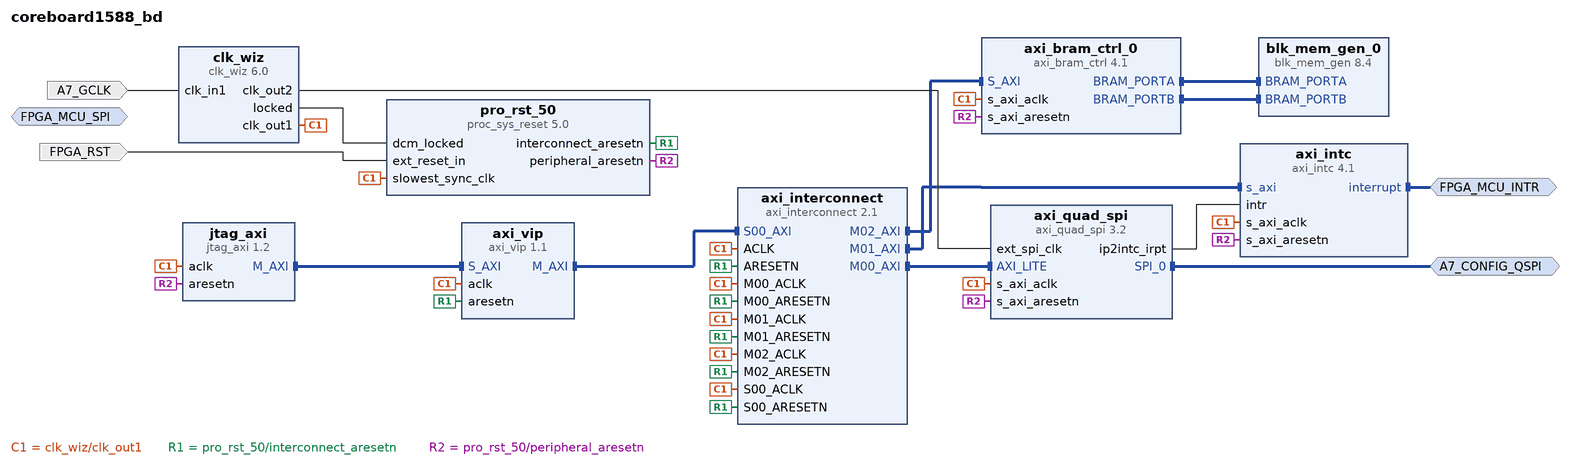
[diagram p0: block diagram of the top level]
# Vivado block design coreboard1588_bd, xc7a35tcsg324-2, Vivado 2019.2
create_bd_design coreboard1588_bd

create_bd_intf_port -mode Master -vlnv xilinx.com:interface:spi_rtl:1.0 A7_CONFIG_QSPI
create_bd_intf_port -mode Master -vlnv xilinx.com:interface:mbinterrupt_rtl:1.0 FPGA_MCU_INTR
create_bd_intf_port -mode Slave -vlnv xilinx.com:interface:spi_rtl:1.0 FPGA_MCU_SPI
create_bd_port -dir I -type rst FPGA_RST
set_property -dict {CONFIG.POLARITY ACTIVE_LOW} [get_bd_ports FPGA_RST]
create_bd_port -dir I -type clk A7_GCLK
set_property -dict {CONFIG.CLK_DOMAIN A7_GCLK CONFIG.FREQ_HZ 50000000} [get_bd_ports A7_GCLK]

create_bd_cell -type ip -vlnv xilinx.com:ip:jtag_axi:1.2 jtag_axi
set_property -dict {CONFIG.PROTOCOL 2} [get_bd_cells jtag_axi]
create_bd_cell -type ip -vlnv xilinx.com:ip:axi_interconnect:2.1 axi_interconnect
set_property -dict {CONFIG.NUM_MI 3} [get_bd_cells axi_interconnect]
create_bd_cell -type ip -vlnv xilinx.com:ip:axi_quad_spi:3.2 axi_quad_spi
set_property -dict {CONFIG.Async_Clk 0 CONFIG.C_SPI_MEMORY 2 CONFIG.C_SPI_MODE 2} [get_bd_cells axi_quad_spi]
create_bd_cell -type ip -vlnv xilinx.com:ip:clk_wiz:6.0 clk_wiz
set_property -dict [list \
  CONFIG.CLKOUT2_JITTER 249.363 \
  CONFIG.CLKOUT2_PHASE_ERROR 164.985 \
  CONFIG.CLKOUT2_REQUESTED_OUT_FREQ 20 \
  CONFIG.CLKOUT2_USED true \
  CONFIG.MMCM_CLKOUT1_DIVIDE 50 \
  CONFIG.NUM_OUT_CLKS 2 \
  CONFIG.RESET_PORT resetn \
  CONFIG.RESET_TYPE ACTIVE_LOW \
  CONFIG.USE_RESET false \
] [get_bd_cells clk_wiz]
create_bd_cell -type ip -vlnv xilinx.com:ip:proc_sys_reset:5.0 pro_rst_50
set_property -dict {CONFIG.C_NUM_PERP_ARESETN 4} [get_bd_cells pro_rst_50]
create_bd_cell -type ip -vlnv xilinx.com:ip:axi_intc:4.1 axi_intc
create_bd_cell -type ip -vlnv xilinx.com:ip:blk_mem_gen:8.4 blk_mem_gen_0
set_property -dict [list \
  CONFIG.Assume_Synchronous_Clk true \
  CONFIG.EN_SAFETY_CKT true \
  CONFIG.Enable_32bit_Address true \
  CONFIG.Memory_Type True_Dual_Port_RAM \
  CONFIG.Register_PortA_Output_of_Memory_Primitives false \
  CONFIG.Use_RSTA_Pin true \
  CONFIG.use_bram_block BRAM_Controller \
] [get_bd_cells blk_mem_gen_0]
create_bd_cell -type ip -vlnv xilinx.com:ip:axi_bram_ctrl:4.1 axi_bram_ctrl_0
set_property -dict {CONFIG.PROTOCOL AXI4LITE CONFIG.READ_LATENCY 2} [get_bd_cells axi_bram_ctrl_0]
create_bd_cell -type ip -vlnv xilinx.com:ip:axi_vip:1.1 axi_vip

# ---- connections ----

connect_bd_intf_net [get_bd_intf_pins axi_interconnect/M02_AXI] [get_bd_intf_pins axi_bram_ctrl_0/S_AXI]
connect_bd_intf_net -intf_net axi_quad_spi_0_SPI_0 [get_bd_intf_ports A7_CONFIG_QSPI] [get_bd_intf_pins axi_quad_spi/SPI_0]
connect_bd_intf_net -intf_net axi_intc_0_interrupt [get_bd_intf_ports FPGA_MCU_INTR] [get_bd_intf_pins axi_intc/interrupt]
connect_bd_intf_net -intf_net axi_interconnect_0_M00_AXI [get_bd_intf_pins axi_interconnect/M00_AXI] [get_bd_intf_pins axi_quad_spi/AXI_LITE]
connect_bd_intf_net -intf_net axi_vip_0_M_AXI [get_bd_intf_pins axi_vip/M_AXI] [get_bd_intf_pins axi_interconnect/S00_AXI]
connect_bd_intf_net [get_bd_intf_pins blk_mem_gen_0/BRAM_PORTA] [get_bd_intf_pins axi_bram_ctrl_0/BRAM_PORTA]
connect_bd_intf_net [get_bd_intf_pins blk_mem_gen_0/BRAM_PORTB] [get_bd_intf_pins axi_bram_ctrl_0/BRAM_PORTB]
connect_bd_intf_net [get_bd_intf_pins jtag_axi/M_AXI] [get_bd_intf_pins axi_vip/S_AXI]
connect_bd_intf_net -intf_net axi_interconnect_0_M01_AXI [get_bd_intf_pins axi_interconnect/M01_AXI] [get_bd_intf_pins axi_intc/s_axi]
connect_bd_net [get_bd_pins clk_wiz/clk_out1] \
  [get_bd_pins axi_interconnect/ACLK] [get_bd_pins pro_rst_50/slowest_sync_clk] [get_bd_pins jtag_axi/aclk] \
  [get_bd_pins axi_interconnect/S00_ACLK] [get_bd_pins axi_quad_spi/s_axi_aclk] [get_bd_pins axi_interconnect/M00_ACLK] \
  [get_bd_pins axi_interconnect/M01_ACLK] [get_bd_pins axi_intc/s_axi_aclk] [get_bd_pins axi_bram_ctrl_0/s_axi_aclk] \
  [get_bd_pins axi_interconnect/M02_ACLK] [get_bd_pins axi_vip/aclk]
connect_bd_net [get_bd_pins clk_wiz/locked] [get_bd_pins pro_rst_50/dcm_locked]
connect_bd_net -net ARESETN_1 [get_bd_pins pro_rst_50/interconnect_aresetn] \
  [get_bd_pins axi_interconnect/ARESETN] [get_bd_pins axi_vip/aresetn] [get_bd_pins axi_interconnect/S00_ARESETN] \
  [get_bd_pins axi_interconnect/M00_ARESETN] [get_bd_pins axi_interconnect/M01_ARESETN] \
  [get_bd_pins axi_interconnect/M02_ARESETN]
connect_bd_net -net reset_rtl_0_1 [get_bd_ports FPGA_RST] [get_bd_pins pro_rst_50/ext_reset_in]
connect_bd_net [get_bd_ports A7_GCLK] [get_bd_pins clk_wiz/clk_in1]
connect_bd_net [get_bd_pins clk_wiz/clk_out2] [get_bd_pins axi_quad_spi/ext_spi_clk]
connect_bd_net -net axi_quad_spi_0_ip2intc_irpt [get_bd_pins axi_quad_spi/ip2intc_irpt] [get_bd_pins axi_intc/intr]
connect_bd_net [get_bd_pins pro_rst_50/peripheral_aresetn] \
  [get_bd_pins axi_bram_ctrl_0/s_axi_aresetn] [get_bd_pins axi_intc/s_axi_aresetn] [get_bd_pins axi_quad_spi/s_axi_aresetn] \
  [get_bd_pins jtag_axi/aresetn]

# ---- address map ----
assign_bd_address -offset 0x00000000 -range 1K -target_address_space [get_bd_addr_spaces jtag_axi/Data] [get_bd_addr_segs axi_quad_spi/AXI_LITE/Reg]
assign_bd_address -offset 0x00000400 -range 1K -target_address_space [get_bd_addr_spaces jtag_axi/Data] [get_bd_addr_segs axi_intc/S_AXI/Reg]
assign_bd_address -offset 0x00000800 -range 1K -target_address_space [get_bd_addr_spaces jtag_axi/Data] [get_bd_addr_segs axi_bram_ctrl_0/S_AXI/Mem0]

set_property USER_COMMENTS.comment_0 {50 MHz single end clock from external} [current_bd_design]

validate_bd_design
save_bd_design
